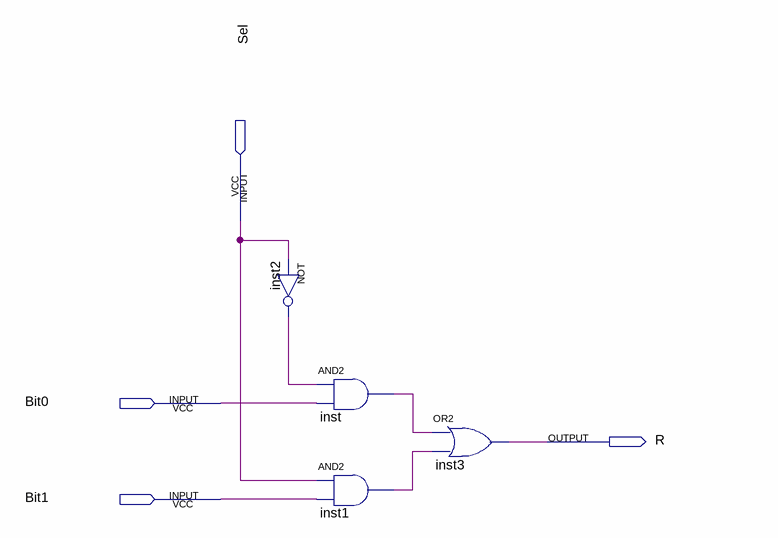
[diagram p0: schematic sheet]
// Quartus schematic Mux2Bits.bdf as structural Verilog: 4 symbols, 4 pins
module Mux2Bits (
  input  Sel,
  input  Bit0,
  input  Bit1,
  output R
);

  wire inst1_out, inst2_out, inst_out;

  not inst2 (inst2_out, Sel);
  and inst (inst_out, inst2_out, Bit0);
  and inst1 (inst1_out, Sel, Bit1);
  or inst3 (R, inst_out, inst1_out);
endmodule
